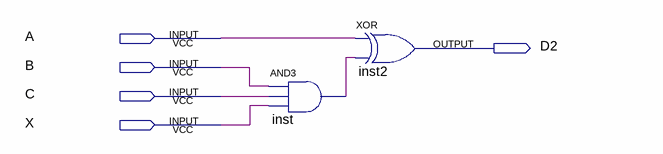
[diagram p0: schematic sheet]
// Quartus schematic F2.bdf as structural Verilog: 2 symbols, 5 pins
module F2 (
  input  A,
  input  B,
  input  C,
  input  X,
  output D2
);

  wire inst_out;

  and inst (inst_out, B, C, X);
  xor inst2 (D2, A, inst_out);
endmodule
